# EAGLE design Mainboard (EAGLE 6.3)
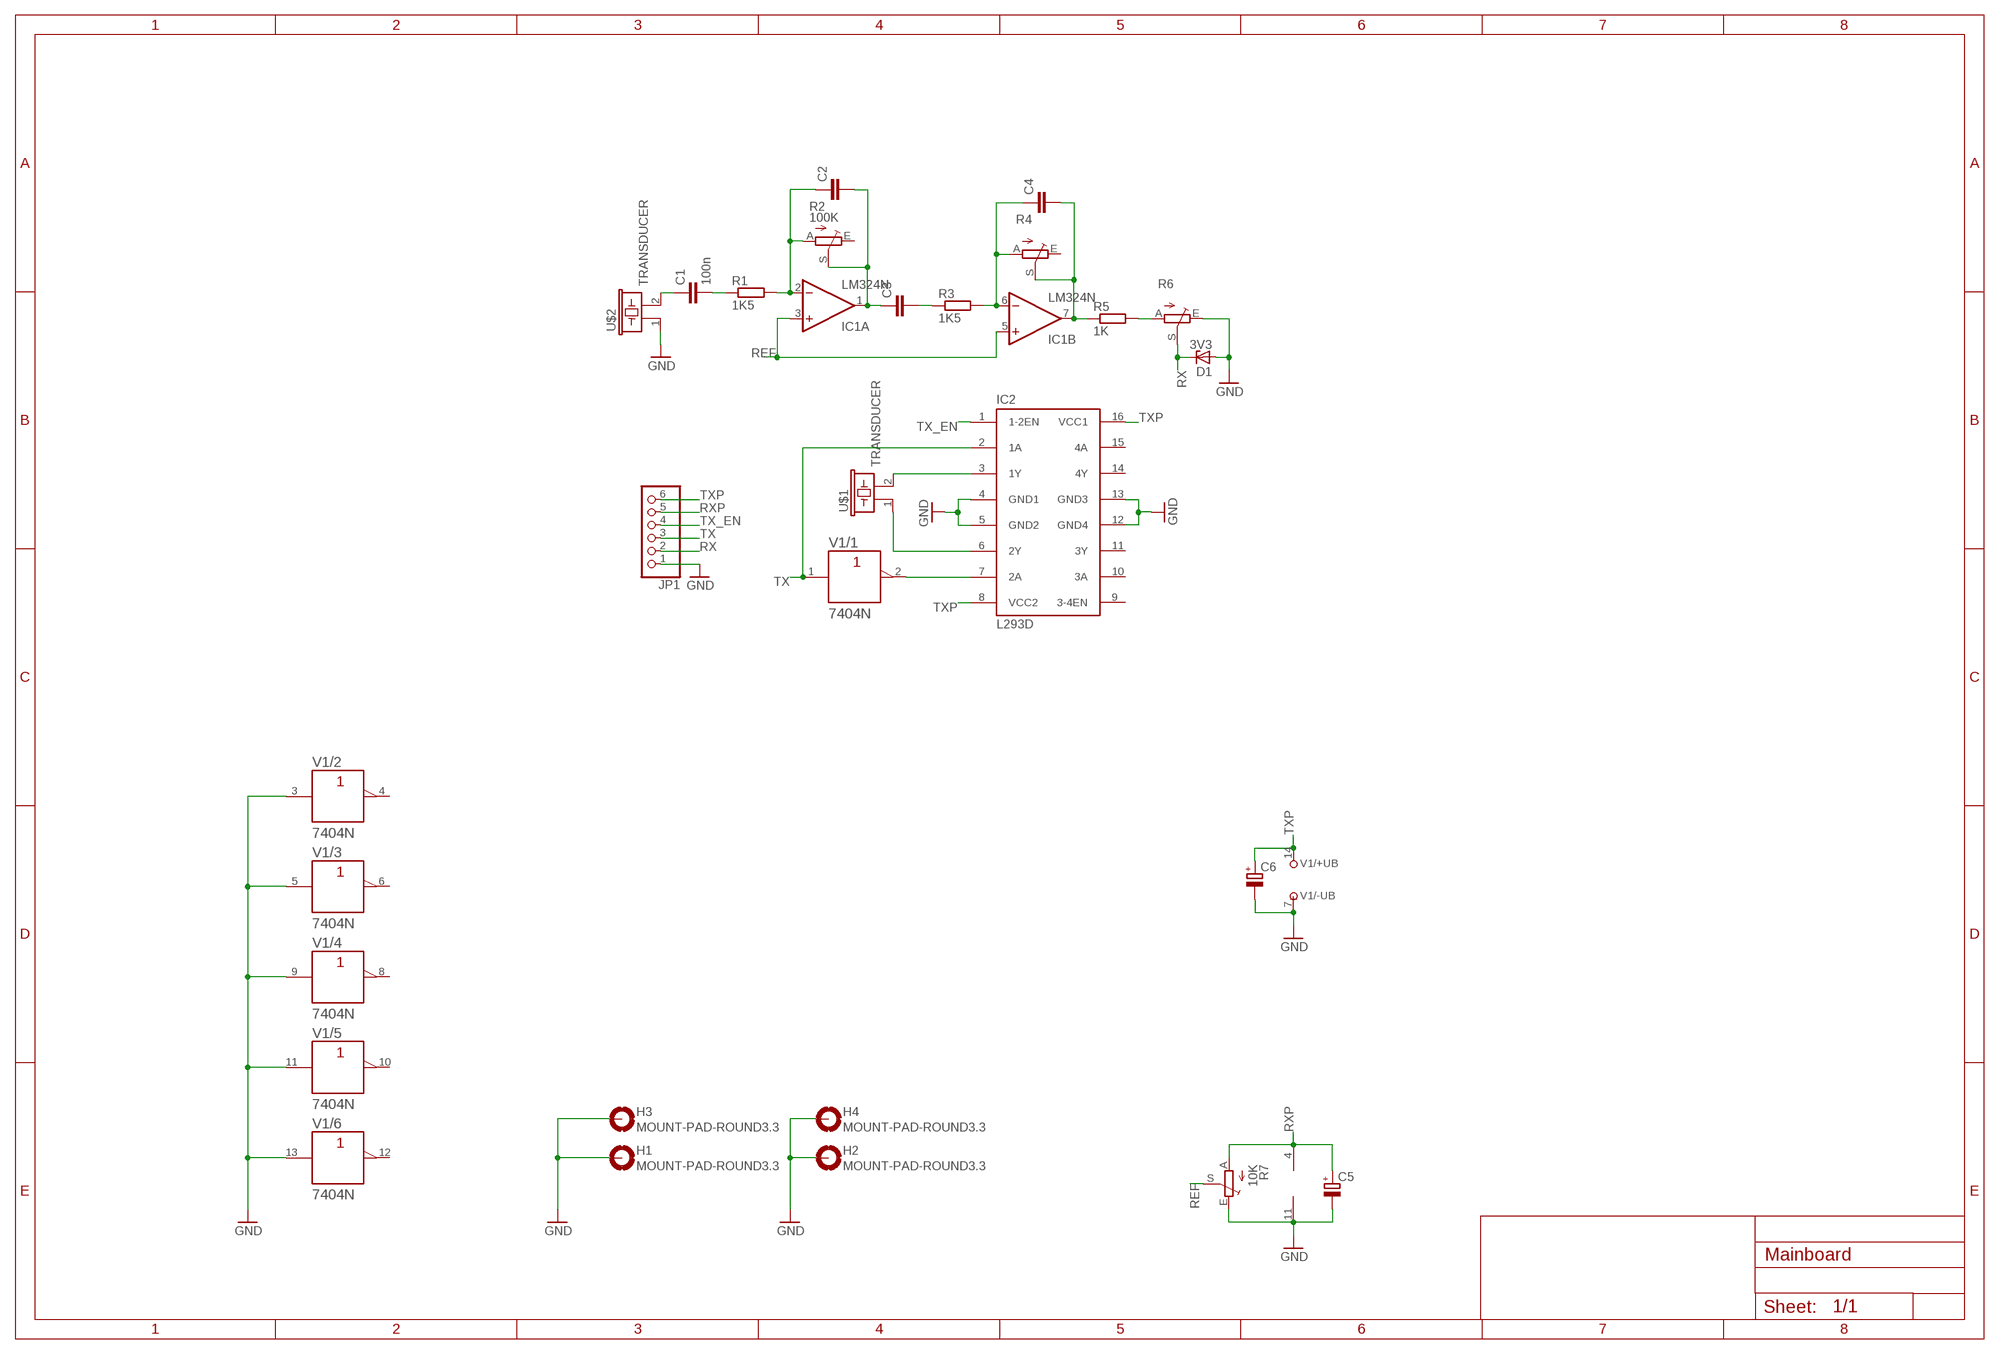
[diagram p0: schematic, sheet 1]

## Parts
C1  100n  C-EU025-025X050  [C025-025X050]
C2  C-EU025-025X050  [C025-025X050]
C3  C-EU025-025X050  [C025-025X050]
C4  C-EU025-025X050  [C025-025X050]
C5  CPOL-EUE2-5  [E2-5]
C6  CPOL-EUE2-5  [E2-5]
D1  3V3  ZENER-DIODEZD-2.5  [ZDIO-2.5]
H1  MOUNT-PAD-ROUND3.3  [3,3-PAD]
H2  MOUNT-PAD-ROUND3.3  [3,3-PAD]
H3  MOUNT-PAD-ROUND3.3  [3,3-PAD]
H4  MOUNT-PAD-ROUND3.3  [3,3-PAD]
IC1  LM324N  [DIL14]
IC2  L293D  [DIL16]
JP1  PINHD-1X6  [1X06]
R1  1K5  R-EU_0207/2V  [0207/2V]
R2  100K  TRIM_EU-S63P  [S63P]
R3  1K5  R-EU_0207/2V  [0207/2V]
R4  TRIM_EU-S63P  [S63P]
R5  1K  R-EU_0207/2V  [0207/2V]
R6  TRIM_EU-S63P  [S63P]
R7  10K  TRIM_EU-S63P  [S63P]
U$1  TRANSDUCER  [TRANSDUCER]
U$2  TRANSDUCER  [TRANSDUCER]
V1  7404N  [DIL14]

## Nets
GND: C5.- C6.- D1.A H1.B3,3(MOUNT) H2.B3,3(MOUNT) H3.B3,3(MOUNT) H4.B3,3(MOUNT) IC1.11(P:V-) IC2.4(GND1) IC2.5(GND2) IC2.12(GND4) IC2.13(GND3) JP1.1 R6.E R7.E U$2.1 V1.3(/2:A) V1.5(/3:A) V1.7(/-UB:-UB) V1.9(/4:A) V1.11(/5:A) V1.13(/6:A)
N$1: C2.1 IC1.2(A:-IN) R1.2 R2.A
N$2: C1.2 R1.1
N$3: C2.2 C3.1 IC1.1(A:OUT) R2.S
N$4: R5.2 R6.A
N$5: C3.2 R3.1
N$6: C4.1 IC1.6(B:-IN) R3.2 R4.A
N$7: C4.2 IC1.7(B:OUT) R4.S R5.1
N$8: IC2.7(2A) V1.2(/1:Y)
N$9: C1.1 U$2.2
N$10: IC2.3(1Y) U$1.2
N$11: IC2.6(2Y) U$1.1
REF: IC1.3(A:+IN) IC1.5(B:+IN) R7.S
RX: D1.C JP1.2 R6.S
RXP: C5.+ IC1.4(P:V+) JP1.5 R7.A
TX: IC2.2(1A) JP1.3 V1.1(/1:A)
TX_EN: IC2.1(1-2EN) JP1.4
TXP: C6.+ IC2.8(VCC2) IC2.16(VCC1) JP1.6 V1.14(/+UB:+UB)
Unconnected: IC1.8(C:OUT) IC1.9(C:-IN) IC1.10(C:+IN) IC1.12(D:+IN) IC1.13(D:-IN) IC1.14(D:OUT) IC2.9(3-4EN) IC2.10(3A) IC2.11(3Y) IC2.14(4Y) IC2.15(4A) R2.E R4.E V1.4(/2:Y) V1.6(/3:Y) V1.8(/4:Y) V1.10(/5:Y) V1.12(/6:Y)

## Library data of the parts
C1-C4 = rcl:C-EU: CAPACITOR, European symbol
C5 C6 = rcl:CPOL-EU: POLARIZED CAPACITOR, European symbol
D1 = diode:ZENER-DIODE: Z-Diode
H1-H4 = holes:MOUNT-PAD-ROUND: MOUNTING PAD, round
IC1 = linear:LM324: OP AMP
IC2 = st-microelectronics:L293D: PUSH-PULL 4 CHANNEL DRIVER; MPN: L293D; OC_FARNELL: 9589619; OC_NEWARK: 56P8249
JP1 = pinhead:PINHD-1X6: PIN HEADER
R1 R3 R5 = rcl:R-EU_: RESISTOR, European symbol
R2 R4 R6 R7 = pot:TRIM_EU-: POTENTIOMETER
U$1 U$2 = Ultrasound:TRANSDUCER
V1 = 74ttl-din:74*04: Hex INVERTER

## Board
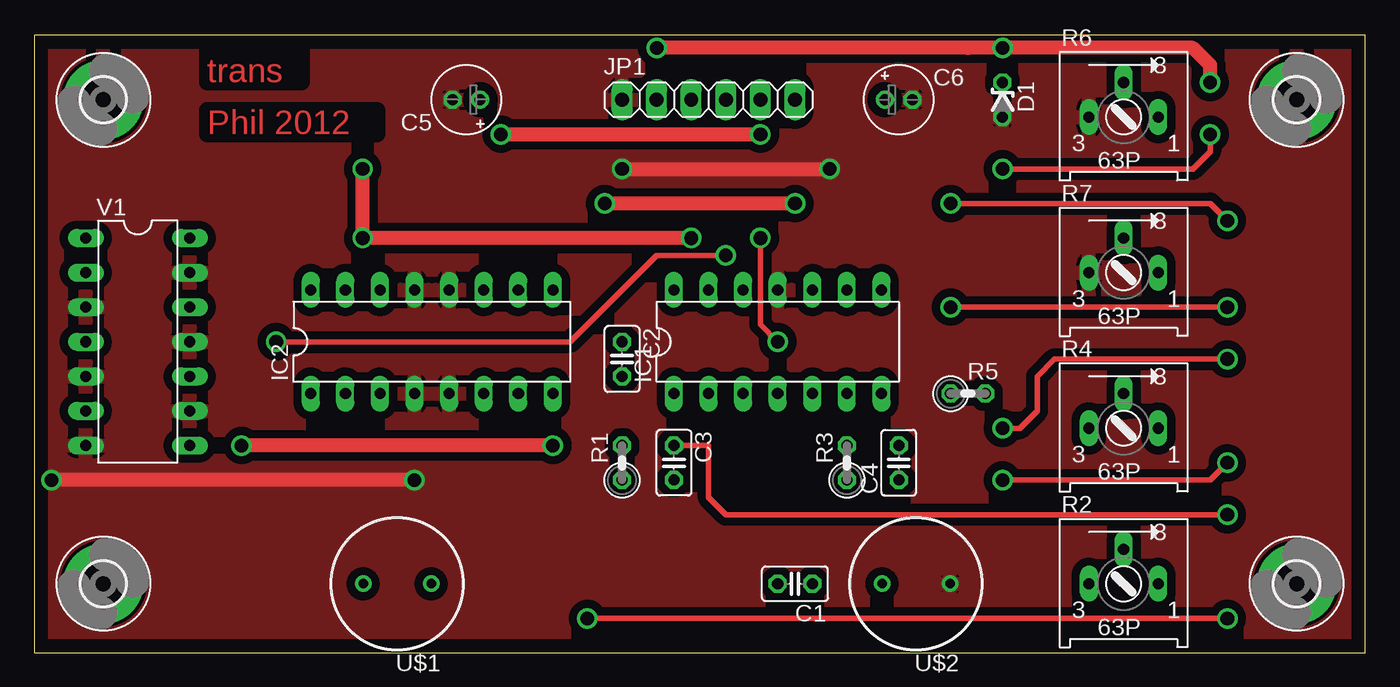
[diagram p1: board, top side]
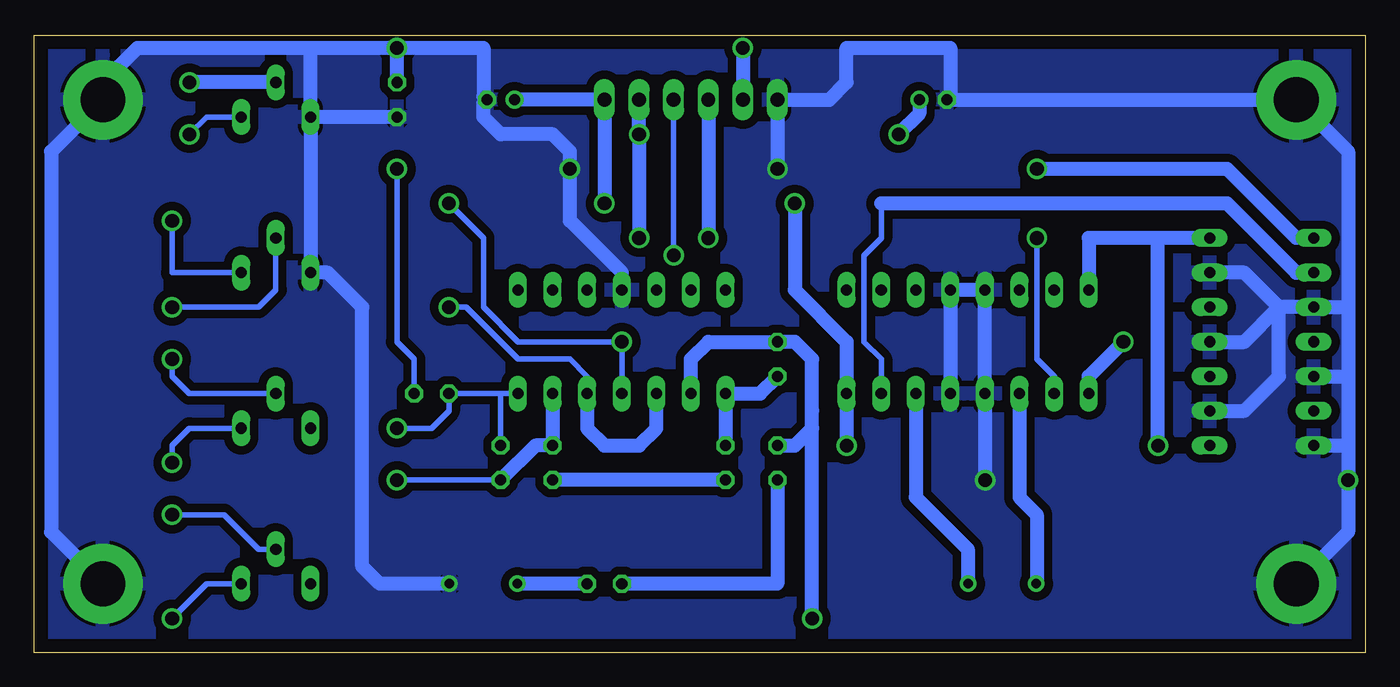
[diagram p2: board, bottom side, seen from below]

Size 97.77 x 45.39 mm. Coordinates in mm from the lower left corner, seen from the top.
Outline: 0,0 97.77,0 97.77,45.39 0,45.39 0,0
Copper layers (1*16): Top 0.035mm / dielectric 1.5mm / Bottom 0.035mm
Design rules "default": minimum track width 10mil, minimum drill 24mil, track to track 8mil, track to pad 8mil, pad to pad 8mil, via to via 8mil, smd to smd 8mil, copper to edge 40mil, drill to drill 8mil, minimum pad ring 10mil, minimum via ring 8mil, stop-mask expansion 4mil, vias tented up to drill 0mil, thermal gap 10mil

### Footprints (pad centres in the part's own frame; a part is rotated, then mirrored left to right if it is on the bottom)
C025-025X050 = drill 0.813 octagon: 1 -1.27,0; 2 1.27,0
E2-5 = drill 0.813 pad 1.27: + -1.016,0 | drill 0.813 pad 1.27 octagon: - 1.016,0
ZDIO-2.5 = drill 0.813 octagon: A 1.27,0; C -1.27,0
3,3-PAD = drill 3.3 pad 5.842: B3,3 0,0
DIL14 = drill 0.813 long: 1 -7.62,-3.81; 2 -5.08,-3.81; 3 -2.54,-3.81; 4 0,-3.81; 5 2.54,-3.81; 6 5.08,-3.81; 7 7.62,-3.81; 8 7.62,3.81; 9 5.08,3.81; 10 2.54,3.81; 11 0,3.81; 12 -2.54,3.81; 13 -5.08,3.81; 14 -7.62,3.81
DIL16 = drill 0.813 long: 1 -8.89,-3.81; 2 -6.35,-3.81; 3 -3.81,-3.81; 4 -1.27,-3.81; 5 1.27,-3.81; 6 3.81,-3.81; 7 6.35,-3.81; 8 8.89,-3.81; 9 8.89,3.81; 10 6.35,3.81; 11 3.81,3.81; 12 1.27,3.81; 13 -1.27,3.81; 14 -3.81,3.81; 15 -6.35,3.81; 16 -8.89,3.81
1X06 = drill 1.016 long: 1 -6.35,0; 2 -3.81,0; 3 -1.27,0; 4 1.27,0; 5 3.81,0; 6 6.35,0
0207/2V = drill 0.813 octagon: 1 -1.27,0; 2 1.27,0
S63P = drill 0.813 long: A 2.54,0; E -2.54,0; S 0,2.54
TRANSDUCER = drill 0.7: 1 -2.5,0; 2 2.5,0

### Placement (x,y rotation side)
C1  55.88,5.08 180 top
C2  43.18,21.59 270 top
C3  46.99,13.97 270 top
C4  63.5,13.97 90 top
C5  31.75,40.64 180 top
C6  63.5,40.64 0 top
D1  71.12,40.64 270 top
H1  5.08,5.08 0 top
H2  5.08,40.64 0 top
H3  92.71,5.08 0 top
H4  92.71,40.64 0 top
IC1  54.61,22.86 0 top
IC2  29.21,22.86 0 top
JP1  49.53,40.64 0 top
R1  43.18,13.97 90 top
R2  80.01,5.08 0 top
R3  59.69,13.97 90 top
R4  80.01,16.51 0 top
R5  68.58,19.05 0 top
R6  80.01,39.37 0 top
R7  80.01,27.94 0 top
U$1  26.67,5.08 180 top
U$2  64.77,5.08 180 top
V1  7.62,22.86 270 top

### Tracks (layer width: path | path; a pad name or v marks a point on that pad's centre or on a via)
GND  (via drill 1 pad 1.27)
  Top 1.016: v27.94,12.7 v1.27,12.7 | v43.18,35.56 v58.42,35.56
  Bottom 1.016: IC2.5 IC2.12 IC2.13 IC2.4 v27.94,12.7 | 1.27,25.4 V1.3 6.35,25.4 | 1.27,25.4 1.27,20.32 | 1.27,20.32 1.27,15.24 | V1.5 1.27,20.32 | V1.7 1.27,15.24 | 1.27,15.24 v1.27,12.7 1.27,8.89 H1.B3,3 | 1.27,25.4 1.27,36.83 H2.B3,3 C5.- 30.48,40.89 30.48,44.45 38.1,44.45 38.1,41.91 39.37,40.64 JP1.1 v43.18,35.56 | 6.35,25.4 8.89,27.94 V1.13 | V1.11 8.89,22.86 6.35,25.4 | V1.9 8.89,17.78 6.35,20.32 6.35,25.4 | H3.B3,3 96.52,8.89 96.52,36.83 H4.B3,3 92.71,41.91 90.17,44.45 77.47,44.45 | 77.47,44.45 64.77,44.45 64.77,40.89 C6.- 64.77,40.39 64.77,39.37 63.5,38.1 59.69,38.1 58.42,36.83 v58.42,35.56 58.42,31.75 54.61,27.94 IC1.11 | R6.E R7.E 76.2,27.94 73.66,25.4 73.66,6.35 72.39,5.08 U$2.1 | R6.E 77.47,44.45 | D1.A R6.E
  pour Bottom (isolate 0.61): -1.27,45.72 97.79,45.72 97.79,0 -1.27,0
  pour Top (isolate 0.61): -3.81,45.72 99.06,45.72 99.06,0 -3.81,0
N$1  (via drill 1 pad 1.27)
  Top 0.406: v87.63,2.54 v40.64,2.54
  Bottom 0.406: R2.A 85.09,5.08 v87.63,2.54
  Bottom 1.016: IC1.2 49.53,21.59 48.26,22.86 C2.1 41.91,22.86 40.64,21.59 40.64,17.78 | R1.2 41.91,15.24 40.64,16.51 40.64,17.78 | v40.64,2.54 40.64,17.78
N$2
  Bottom 1.016: R1.1 43.18,5.08 C1.2
N$3  (via drill 1 pad 1.27)
  Top 0.406: v87.63,10.16 50.8,10.16 49.53,11.43 49.53,15.24 C3.1
  Bottom 0.406: R2.S 81.28,7.62 83.82,10.16 v87.63,10.16
  Bottom 1.016: C2.2 44.45,19.05 IC1.1 C3.1
N$4  (via drill 1 pad 1.27)
  Top 0.406: v86.36,38.1 86.36,36.83 85.09,35.56 v71.12,35.56
  Bottom 0.406: R6.A 85.09,39.37 v86.36,38.1 | v71.12,35.56 71.12,22.86 69.85,21.59 R5.2
N$5
  Bottom 1.016: C3.2 R3.1
N$6  (via drill 1 pad 1.27)
  Top 0.406: v71.12,12.7 86.36,12.7 v87.63,13.97
  Bottom 0.406: C4.1 v71.12,12.7 | v87.63,13.97 87.63,15.24 86.36,16.51 R4.A
  Bottom 1.016: IC1.6 R3.2 60.96,15.24 C4.1
N$7  (via drill 1 pad 1.27)
  Top 0.406: v71.12,16.51 72.39,16.51 73.66,17.78 73.66,20.32 74.93,21.59 v87.63,21.59
  Bottom 0.406: 63.5,19.05 R5.1 67.31,17.78 68.58,16.51 v71.12,16.51 | v87.63,21.59 87.63,20.32 86.36,19.05 R4.S | IC1.7 63.5,19.05 | 63.5,19.05 C4.2
N$8
  Bottom 0.406: 35.56,33.02 35.56,30.48 36.83,29.21 36.83,22.86 35.56,21.59 IC2.7
  Bottom 1.016: V1.2 5.08,27.94 10.16,33.02 35.56,33.02
N$9
  Bottom 1.016: C1.1 U$2.2
N$10
  Bottom 0.406: 24.13,5.12 U$1.2
  Bottom 1.016: IC2.3 25.4,11.43 24.13,10.16 24.13,5.12
N$11
  Bottom 0.406: 29.21,5.12 U$1.1
  Bottom 1.016: IC2.6 33.02,11.43 29.21,7.62 29.21,5.12
REF  (via drill 1 pad 1.27)
  Top 0.406: v67.31,25.4 v87.63,25.4
  Bottom 0.406: IC1.5 57.15,20.32 58.42,21.59 62.23,21.59 66.04,25.4 v67.31,25.4 | v87.63,25.4 81.28,25.4 80.01,26.67 R7.S
  Bottom 1.016: IC1.5 57.15,16.51 55.88,15.24 53.34,15.24 52.07,16.51 IC1.3
RX  (via drill 1 pad 1.27)
  Top 1.016: v86.36,41.91 86.36,43.18 85.09,44.45 v71.12,44.45 68.58,44.45 v45.72,44.45
  Bottom 1.016: R6.S v86.36,41.91 | v45.72,44.45 JP1.2 | D1.C v71.12,44.45
RXP  (via drill 1 pad 1.27)
  Top 0.406: v53.34,30.48 53.34,24.13 v54.61,22.86 | v67.31,33.02 86.36,33.02 v87.63,31.75
  Top 1.016: v34.29,38.1 v53.34,38.1
  Bottom 0.406: IC1.4 v54.61,22.86 62.23,22.86 64.77,25.4 64.77,30.48 v67.31,33.02 | v87.63,31.75 87.63,27.94 R7.A
  Bottom 1.016: C5.+ 32.77,39.62 v34.29,38.1 | JP1.5 v53.34,38.1 v53.34,30.48
TX  (via drill 1 pad 1.27)
  Top 1.016: v48.26,30.48 26.67,30.48 v24.13,30.48 v24.13,35.56
  Bottom 0.406: IC2.2 22.86,20.32 24.13,21.59 v24.13,30.48
  Bottom 1.016: V1.1 5.08,30.48 10.16,35.56 v24.13,35.56 | JP1.3 v48.26,30.48
TX_EN  (via drill 1 pad 1.27)
  Top 0.406: v17.78,22.86 39.37,22.86 45.72,29.21 v50.8,29.21
  Bottom 0.406: v50.8,29.21 JP1.4
  Bottom 1.016: IC2.1 20.32,20.32 v17.78,22.86
TXP  (via drill 1 pad 1.27)
  Top 1.016: v38.1,15.24 v15.24,15.24 | v55.88,33.02 v41.91,33.02
  Bottom 1.016: V1.14 15.24,30.48 | 15.24,30.48 20.32,30.48 IC2.16 | v38.1,15.24 IC2.8 38.1,22.86 41.91,26.67 v41.91,33.02 | v15.24,15.24 15.24,30.48 | C6.+ JP1.6 v55.88,33.02

### Text on the board
Top: trans | Phil 2012